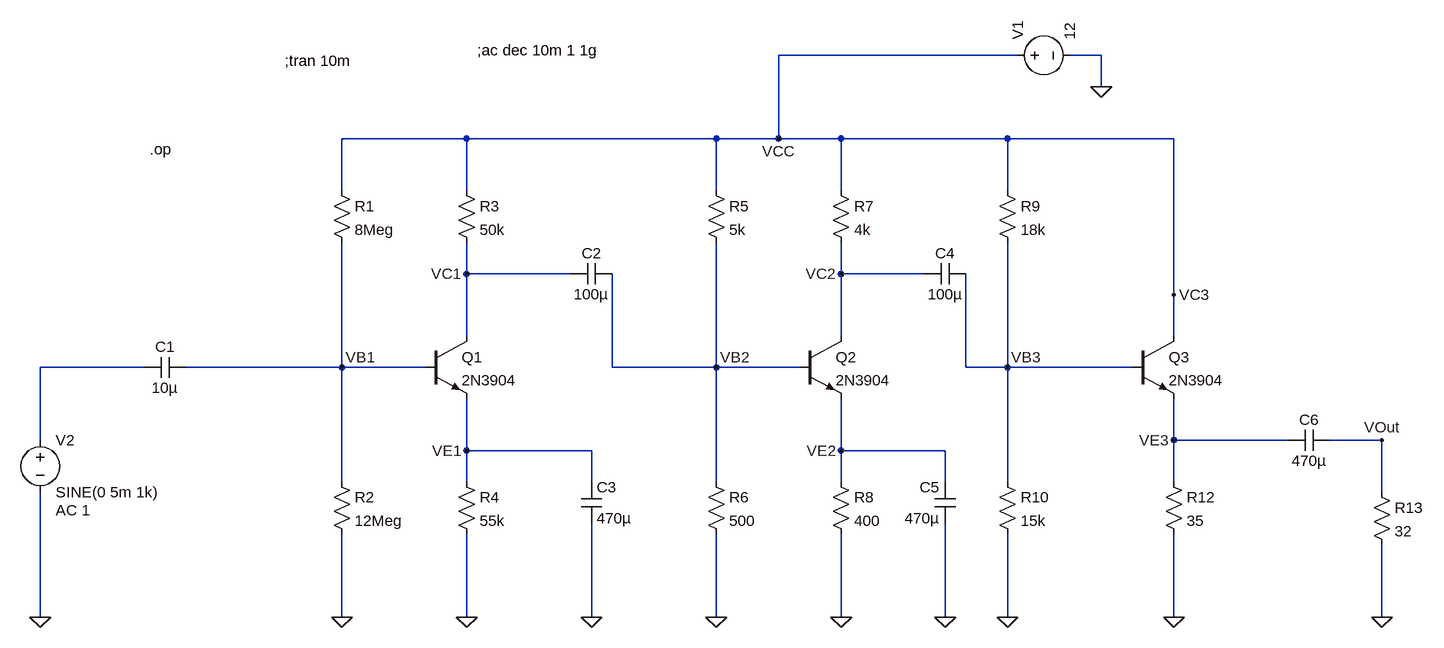
[diagram p0: schematic Completed 1.asc]
Completed 1.asc, the LTspice schematic file:
Version 4
SHEET 1 1908 680
WIRE 1232 -384 864 -384
WIRE 1360 -384 1312 -384
WIRE 1360 -336 1360 -384
WIRE 384 -256 192 -256
WIRE 768 -256 384 -256
WIRE 864 -256 864 -384
WIRE 864 -256 768 -256
WIRE 960 -256 864 -256
WIRE 1216 -256 960 -256
WIRE 1472 -256 1216 -256
WIRE 192 -176 192 -256
WIRE 384 -176 384 -256
WIRE 768 -176 768 -256
WIRE 960 -176 960 -256
WIRE 1216 -176 1216 -256
WIRE 384 -48 384 -96
WIRE 544 -48 384 -48
WIRE 960 -48 960 -96
WIRE 1088 -48 960 -48
WIRE 1472 -16 1472 -256
WIRE 384 48 384 -48
WIRE 960 48 960 -48
WIRE 1472 48 1472 -16
WIRE -112 96 -272 96
WIRE 192 96 192 -96
WIRE 192 96 -48 96
WIRE 320 96 192 96
WIRE 608 96 608 -48
WIRE 768 96 768 -96
WIRE 768 96 608 96
WIRE 896 96 768 96
WIRE 1152 96 1152 -48
WIRE 1216 96 1216 -96
WIRE 1216 96 1152 96
WIRE 1408 96 1216 96
WIRE -272 208 -272 96
WIRE 1472 208 1472 144
WIRE 1648 208 1472 208
WIRE 1792 208 1712 208
WIRE 384 224 384 144
WIRE 576 224 384 224
WIRE 960 224 960 144
WIRE 1120 224 960 224
WIRE 192 272 192 96
WIRE 384 272 384 224
WIRE 576 272 576 224
WIRE 768 272 768 96
WIRE 960 272 960 224
WIRE 1120 272 1120 224
WIRE 1216 272 1216 96
WIRE 1472 272 1472 208
WIRE 1792 288 1792 208
WIRE -272 480 -272 288
WIRE 192 480 192 352
WIRE 384 480 384 352
WIRE 576 480 576 336
WIRE 768 480 768 352
WIRE 960 480 960 352
WIRE 1120 480 1120 336
WIRE 1216 480 1216 352
WIRE 1472 480 1472 352
WIRE 1792 480 1792 368
FLAG -272 480 0
FLAG 192 480 0
FLAG 576 480 0
FLAG 384 480 0
FLAG 768 480 0
FLAG 960 480 0
FLAG 1120 480 0
FLAG 1216 480 0
FLAG 1472 480 0
FLAG 1792 480 0
FLAG 1360 -336 0
FLAG 192 96 VB1
FLAG 384 -48 VC1
FLAG 384 224 VE1
FLAG 768 96 VB2
FLAG 960 -48 VC2
FLAG 960 224 VE2
FLAG 864 -256 VCC
FLAG 1216 96 VB3
FLAG 1472 208 VE3
FLAG 1792 208 VOut
FLAG 1472 -16 VC3
SYMBOL npn 320 48 R0
SYMATTR InstName Q1
SYMATTR Value 2N3904
SYMBOL npn 896 48 R0
SYMATTR InstName Q2
SYMATTR Value 2N3904
SYMBOL npn 1408 48 R0
SYMATTR InstName Q3
SYMATTR Value 2N3904
SYMBOL voltage 1216 -384 R270
WINDOW 123 0 0 Left 0
WINDOW 39 0 0 Left 0
SYMATTR InstName V1
SYMATTR Value 12
SYMBOL voltage -272 192 R0
WINDOW 123 24 124 Left 2
WINDOW 39 0 0 Left 0
SYMATTR Value2 AC 1
SYMATTR InstName V2
SYMATTR Value SINE(0 5m 1k)
SYMBOL cap -48 80 R90
WINDOW 0 0 32 VBottom 2
WINDOW 3 32 32 VTop 2
SYMATTR InstName C1
SYMATTR Value 10µ
SYMBOL res 176 -192 R0
SYMATTR InstName R1
SYMATTR Value 8Meg
SYMBOL res 176 256 R0
SYMATTR InstName R2
SYMATTR Value 12Meg
SYMBOL cap 608 -64 R90
WINDOW 0 0 32 VBottom 2
WINDOW 3 32 32 VTop 2
SYMATTR InstName C2
SYMATTR Value 100µ
SYMBOL res 368 -192 R0
SYMATTR InstName R3
SYMATTR Value 50k
SYMBOL res 368 256 R0
SYMATTR InstName R4
SYMATTR Value 55k
SYMBOL cap 560 272 R0
SYMATTR InstName C3
SYMATTR Value 470µ
SYMBOL res 752 -192 R0
SYMATTR InstName R5
SYMATTR Value 5k
SYMBOL res 752 256 R0
SYMATTR InstName R6
SYMATTR Value 500
SYMBOL res 944 -192 R0
SYMATTR InstName R7
SYMATTR Value 4k
SYMBOL res 944 256 R0
SYMATTR InstName R8
SYMATTR Value 400
SYMBOL res 1200 -192 R0
SYMATTR InstName R9
SYMATTR Value 18k
SYMBOL res 1200 256 R0
SYMATTR InstName R10
SYMATTR Value 15k
SYMBOL res 1456 256 R0
SYMATTR InstName R12
SYMATTR Value 35
SYMBOL cap 1152 -64 R90
WINDOW 0 0 32 VBottom 2
WINDOW 3 32 32 VTop 2
SYMATTR InstName C4
SYMATTR Value 100µ
SYMBOL cap 1136 336 R180
WINDOW 0 24 56 Left 2
WINDOW 3 24 8 Left 2
SYMATTR InstName C5
SYMATTR Value 470µ
SYMBOL cap 1712 192 R90
WINDOW 0 0 32 VBottom 2
WINDOW 3 32 32 VTop 2
SYMATTR InstName C6
SYMATTR Value 470µ
SYMBOL res 1776 272 R0
SYMATTR InstName R13
SYMATTR Value 32
TEXT -104 -240 Left 2 !.op
TEXT 104 -376 Left 2 !;tran 10m
TEXT 400 -392 Left 2 !;ac dec 10m 1 1g

The netlist it stands for:
* Completed 1.asc
Q1 VC1 VB1 VE1 0 2N3904
Q2 VC2 VB2 VE2 0 2N3904
Q3 VC3 VB3 VE3 0 2N3904
V1 VC3 0 12
V2 N001 0 SINE(0 5m 1k) AC 1
C1 VB1 N001 10µ
R1 VC3 VB1 8Meg
R2 VB1 0 12Meg
C2 VB2 VC1 100µ
R3 VC3 VC1 50k
R4 VE1 0 55k
C3 VE1 0 470µ
R5 VC3 VB2 5k
R6 VB2 0 500
R7 VC3 VC2 4k
R8 VE2 0 400
R9 VC3 VB3 18k
R10 VB3 0 15k
R12 VE3 0 35
C4 VB3 VC2 100µ
C5 0 VE2 470µ
C6 VOut VE3 470µ
R13 VOut 0 32
.model NPN NPN
.model PNP PNP
.lib standard.bjt
.op
;tran 10m
;ac dec 10m 1 1g
.backanno
.end